# Altium schematic sheet supply.SchDoc
size A4
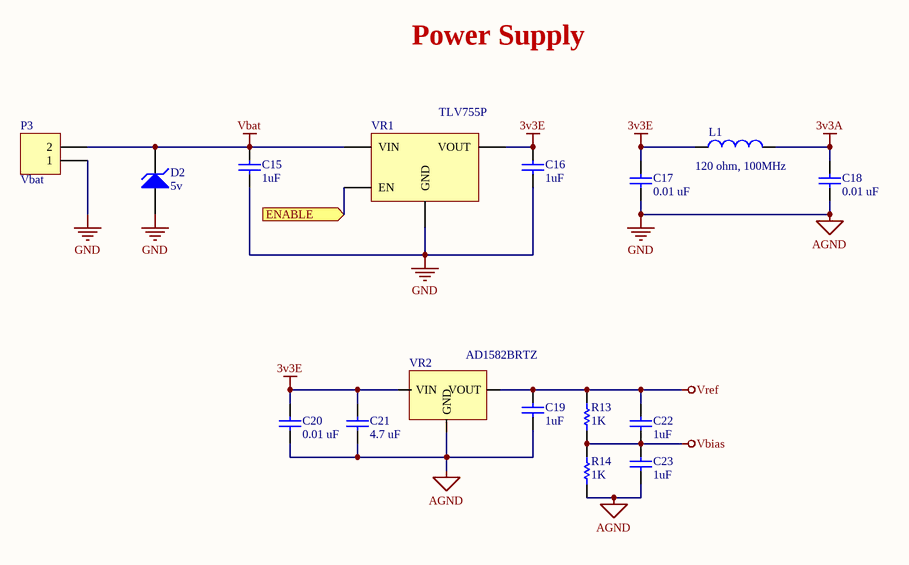
[diagram p0: supply.SchDoc]

## Parts
C15  1uF  [Chip2PinWURTcap]
C16  1uF  [Chip2PinWURTcap]
C17  0.01 uF
C18  0.01 uF
C19  1uF  [Chip2PinWURTcap]
C20  0.01 uF
C21  4.7 uF
C22  1uF  [Chip2PinWURTcap]
C23  1uF  [Chip2PinWURTcap]
D2  5v
L1  120 ohm, 100MHz
P3  Vbat  [HDR1X2]
R13  1K
R14  1K
VR1  TLV755P  [SOT23-TLV755P]
VR2  AD1582BRTZ

## Ports
ENABLE (in)

## Nets
3v3A: C18.1 L1.2
3v3E: C16.1 C17.1 C20.2 C21.2 L1.1 VR1.5(VOUT) VR2.3(VIN)
AGND: C15.2 C16.2 C17.2 C18.2 C19.1 C20.1 C21.1 C23.1 D2.1(A) P3.1 R14.2 VR1.2(GND) VR2.2(GND)  [also labelled GND]
Vbat: C15.1 D2.3(K) P3.2 VR1.1(VIN)
Vbias: C22.1 C23.2 R13.2 R14.1
Vref: C19.2 C22.2 R13.1 VR2.1(VOUT)
ENABLE: VR1.3(EN) ; port ENABLE

## Notes on the sheet
- Power Supply

## Library data of the parts
C15 C16 C19 C22 C23 = 885012206052: Ceramic Capacitors; Manufacturer: Wurth Electronics; Tolerance: 10 %; Voltage Rating DC: 16 VDC; Capacitance - nF: 1000 nF; CNHTS: 8532241000; Dielectric: X7R; TARIC: 8532240000; Published: 8-Jun-2000; LatestRevisionDate: 17-Jul-2002; LatestRevisionNote: Re-released for DXP Platform.; PackageReference: RAD-0.3; Publisher: Altium Limited; PackageDescription: Radial Cap, Thru-Hole; 2 Leads; 0.3 in Pin Spacing; Supplier 1: Mouser; Supplier Part Number 1: 710-885012206052; Manufacturer Part Number: 885012206052; RoHS: RoHS Compliant; Category: Multilayer Ceramic Capacitors MLCC - SMD/SMT; Stock 1: 27157; Pricing 1: 1=0.110, 10=0.104, 50=0.085, 100=0.067, 250=0.059, 500=0.054, 4000=0.054 (EUR); Capacitance: 1 uF; Height: 0.8 mm; Length: 1.6 mm; Package / Case: 0603 (1608 metric); Packaging: Cut Tape; Product: General Type MLCCs; Series: WCAP-CSGP; Termination Style: SMD/SMT; Width: 0.8 mm; Brand: Wurth Electronics; Case Code - in: 0603; Case Code - mm: 1608; HTS Code: 8532240020; Maximum Operating Temperature: + 125 C; Minimum Operating Temperature: - 55 C; Product Type: Ceramic Capacitors; Standard Pack Qty: 4000; Subcategory: Capacitors; RoHS - Mouser: Y; Minimum Order Quantity: 1; Reeling: True; ComponentLink1URL: http://www.mouser.com/datasheet/2/445/885012206052-554330.pdf; ComponentLink1Description: http://www.mouser.com/datasheet/2/445/885012206052-554330.pdf; Value: 1uF
C17 C18 C20 = 885012206089: Multilayer Ceramic Capacitors MLCC - SMD/SMT WCAP-CSGP 0.01uF 0603 10% 50V MLCC; Manufacturer: Wurth Electronics; Voltage Rating DC: 50 VDC; Capacitance - nF: 10 nF; Capacitance - pF: 10000 pF; Dielectric: X7R; Supplier 1: Mouser; Manufacturer Part Number: 885012206089; RoHS: RoHS Compliant; Category: Multilayer Ceramic Capacitors MLCC - SMD/SMT; Stock 1: 174725; Pricing 1: 1=0.040, 10=0.032, 50=0.026, 100=0.021, 250=0.018, 500=0.017, 4000=0.017 (EUR); Capacitance: 0.01 uF; Height: 0.8 mm; Length: 1.6 mm; Package / Case: 0603 (1608 metric); Packaging: Cut Tape; Product: General Type MLCCs; Series: WCAP-CSGP; Termination Style: SMD/SMT; Tolerance: 10 %; Width: 0.8 mm; Brand: Wurth Electronics; Case Code - in: 0603; Case Code - mm: 1608; Maximum Operating Temperature: + 125 C; Minimum Operating Temperature: - 55 C; Product Type: Ceramic Capacitors; Standard Pack Qty: 4000; Subcategory: Capacitors; RoHS - Mouser: Y; Minimum Order Quantity: 1; Reeling: True; ComponentLink1URL: https://www.mouser.com/datasheet/2/445/885012206089-554597.pdf; ComponentLink1Description: https://www.mouser.com/datasheet/2/445/885012206089-554597.pdf; Supplier Part Number 1: 710-885012206089
C21 = 06036D475KAT2A: Multilayer Ceramic Capacitors MLCC - SMD/SMT FACTORY NOT ACCEPTING ORDERS; Manufacturer: AVX; Tolerance: 10 %; Type: Commercial Surface Mount Chip; Voltage Rating DC: 6.3 VDC; Capacitance - nF: 4700 nF; Class: Class 2; Dielectric: X5R; Supplier 1: Mouser; Manufacturer Part Number: 06036D475KAT2A; RoHS: RoHS Compliant By Exemption; Category: Multilayer Ceramic Capacitors MLCC - SMD/SMT; Stock 1: 7820; Pricing 1: 1=0.306, 10=0.216, 100=0.122, 500=0.086, 1000=0.075, 2000=0.063, 4000=0.059, 8000=0.056, 24000=0.050 (EUR); Capacitance: 4.7 uF; Height: 0.9 mm; Length: 1.6 mm; Package / Case: 0603 (1608 metric); Packaging: Reel; Product: General Type MLCCs; Series: X5R; Termination Style: SMD/SMT; Width: 0.81 mm; Brand: AVX; Case Code - in: 0603; Case Code - mm: 1608; Maximum Operating Temperature: + 85 C; Minimum Operating Temperature: - 55 C; Product Type: Ceramic Capacitors; Standard Pack Qty: 4000; Subcategory: Capacitors; RoHS - Mouser: E; Minimum Order Quantity: 8000; Reeling: True; ComponentLink1URL: https://www.mouser.com/datasheet/2/40/cx5r-776519.pdf; ComponentLink1Description: https://www.mouser.com/datasheet/2/40/cx5r-776519.pdf; Supplier Part Number 1: 581-06036D475K
D2 = BZX84B5V1LFHT116: Zener Diodes 5-5.2V 5mA SOT-23; SOT-23; Manufacturer: ROHM Semiconductor; Configuration: Single; Ir - Reverse Current: 2 uA; Pd - Power Dissipation: 250 mW; Voltage Temperature Coefficient: 2.6 mV/C; Zz - Zener Impedance: 60 Ohms; Product Status: New Product; Supplier 1: Mouser; Manufacturer Part Number: BZX84B5V1LFHT116; RoHS: RoHS Compliant; Category: Zener Diodes; Stock 1: 5913; Pricing 1: 1=0.192, 10=0.133, 100=0.055, 1000=0.038, 3000=0.030 (EUR); Height: 0.95 mm; Length: 2.9 mm; Package / Case: SOT-23-3; Packaging: Cut Tape; Width: 1.3 mm; Brand: ROHM Semiconductor; Mounting Style: SMD/SMT; Zener Current: 5 mA; Maximum Operating Temperature: + 150 C; Minimum Operating Temperature: - 65 C; Product Type: Zener Diodes; Standard Pack Qty: 3000; Subcategory: Diodes & Rectifiers; Vz - Zener Voltage: 5 V; RoHS - Mouser: Y; Minimum Order Quantity: 1; Reeling: True; ComponentLink1URL: https://www.mouser.com/datasheet/2/348/bzx84b5v1lfht116-e-1507876.pdf; ComponentLink1Description: https://www.mouser.com/datasheet/2/348/bzx84b5v1lfht116-e-1507876.pdf; Supplier Part Number 1: 755-BZX84B5V1LFHT116
L1 = 2506031217Z0: Ferrite Beads MULTILAYER CHIP BEAD Z=120 OHM@100MHz 25%; Manufacturer: Fair-Rite; Impedance: 120 Ohms; Maximum DC Current: 450 mA; Maximum DC Resistance: 300 mOhms; Type: Multilayer Ferrite Chip Bead; Supplier 1: Mouser; Manufacturer Part Number: 2506031217Z0; RoHS: RoHS Compliant; Category: Ferrite Beads; Stock 1: 9619; Pricing 1: 1=0.032, 2500=0.027, 4000=0.025, 8000=0.024, 24000=0.022, 48000=0.021, 100000=0.018, 400000=0.016 (EUR); Capacitance: -; Height: 0.8 mm; Length: 1.6 mm; Operating Temperature Range: - 55 C to + 125 C; Package / Case: 0603 (1608 metric); Packaging: Cut Tape; Product: Ferrite Chip Beads; Termination Style: SMD/SMT; Tolerance: 25 %; Width: 0.8 mm; Brand: Fair-Rite; Maximum Operating Temperature: + 125 C; Minimum Operating Temperature: - 55 C; Product Type: Ferrite Beads; Standard Pack Qty: 4000; Subcategory: Ferrites; Termination: -; Test Frequency: 100 MHz; RoHS - Mouser: Y; Minimum Order Quantity: 1; Reeling: True; ComponentLink1URL: https://www.mouser.com/datasheet/2/150/2506031217Z0-471794.pdf; ComponentLink1Description: https://www.mouser.com/datasheet/2/150/2506031217Z0-471794.pdf; Supplier Part Number 1: 623-2506031217Z0
P3 = Header 2: Header, 2-Pin; LatestRevisionDate: 17-Jul-2002; LatestRevisionNote: Re-released for DXP Platform.; Publisher: Altium Limited
R13 R14 = CRCW06031K00FKEAC: Thick Film Resistors - SMD 1/10Watt 1Kohms 1% Commercial Use; Manufacturer: Vishay; Power Rating: 100 mW (1/10 W); Temperature Coefficient: 100 PPM / C; Voltage Rating: 75 V; Product Status: New Product; Supplier 1: Mouser; Manufacturer Part Number: CRCW06031K00FKEAC; RoHS: RoHS Compliant By Exemption; Category: Thick Film Resistors - SMD; Stock 1: 673640; Pricing 1: 1=0.087, 10=0.024, 100=0.010, 500=0.006, 1000=0.003, 5000=0.003 (EUR); Features: -; Height: 0.45 mm; Length: 1.55 mm; Package / Case: 0603 (1608 metric); Packaging: Cut Tape; Product: Thick Film Resistors SMD; Resistance: 1 kOhms; Series: CRCW-C e3; Technology: Thick Film; Termination Style: SMD/SMT; Tolerance: 1 %; Width: 0.85 mm; Brand: Vishay; Mounting Style: PCB Mount; Case Code - in: 0603; Case Code - mm: 1608; Maximum Operating Temperature: + 155 C; Minimum Operating Temperature: - 55 C; Product Type: Thick Film Resistors; Standard Pack Qty: 5000; Subcategory: Resistors; RoHS - Mouser: E; Minimum Order Quantity: 1; Reeling: True; ComponentLink1URL: https://www.mouser.com/datasheet/2/427/crcwce3-1223726.pdf; ComponentLink1Description: https://www.mouser.com/datasheet/2/427/crcwce3-1223726.pdf; Supplier Part Number 1: 71-CRCW06031K00FKEAC
VR1 = TLV75533PDBVR: LDO Voltage Regulators 500-mA, Low IQ, Small Size, Low Dropout Regulator 5-SOT-23 -40 to 125; Manufacturer: Texas Instruments; Input Voltage MAX: 5.5 V; Number of Outputs: 1 Output; Output Current: 500 mA; Output Type: Fixed; Output Voltage: 3.3 V; Quiescent Current: 25 uA; Dropout Voltage - Max: 215 mV; PSRR / Ripple Rejection - Typ: 46 dB; Voltage Regulation Accuracy: 1.5 %; CNHTS: 8542319000; Dropout Voltage: 220 mV; Input Voltage MIN: 1.45 V; Line Regulation: 2 mV; Load Regulation: 0.06 V/A; Polarity: Positive; Product Status: New Product; Supplier 1: Mouser; Manufacturer Part Number: TLV75533PDBVR; RoHS: RoHS Compliant; Category: LDO Voltage Regulators; Stock 1: 48621; Pricing 1: 1=0.541, 10=0.454, 100=0.292, 1000=0.234, 2000=0.212, 3000=0.197, 9000=0.190 (EUR); Operating Temperature Range: - 40 C to + 125 C; Package / Case: SOT-23-5; Packaging: Cut Tape; Product: LDO Voltage Regulators; Series: TLV755P; Type: Low Quiescent Current, Ultra Small; Brand: Texas Instruments; Mounting Style: SMD/SMT; Output Voltage Range: -; HTS Code: 8542390001; Maximum Operating Temperature: + 125 C; Minimum Operating Temperature: - 40 C; Product Type: LDO Voltage Regulators; Standard Pack Qty: 3000; Subcategory: PMIC - Power Management ICs; RoHS - Mouser: Y; Minimum Order Quantity: 1; Reeling: True; Supplier Part Number 1: 595-TLV75533PDBVR
VR2 = AD1582BRTZ-REEL7: Voltage References 2.5V MICROPOWER REF IC; Manufacturer: Analog Devices; Accuracy: 3.5 mV/mA; Description/Function: 2.5 V micropower, precision series mode voltage reference; Input Voltage: 2.7 V to 12 V; Output Current: 5 mA; Temperature Coefficient: 50 PPM/C; Reference Type: Series Precision References; Topology: Series References; Operating Supply Current: 70 uA; Supplier 1: Mouser; Manufacturer Part Number: AD1582BRTZ-REEL7; RoHS: RoHS Compliant; Category: Voltage References; Stock 1: 7339; Pricing 1: 1=1.97, 10=1.79, 25=1.60, 100=1.46, 250=1.31, 500=1.14, 1000=0.952, 3000=0.919 (EUR); Height: 1.02 mm (Max); Length: 2.9 mm; Output Voltage: 2.5 V; Package / Case: SOT-23-3; Packaging: Cut Tape; Product: Voltage References; Series: AD1582; Width: 1.3 mm; Brand: Analog Devices; Mounting Style: SMD/SMT; Shunt Current - Max: 5 mA; Load Regulation: 3.5 mV/mA; Maximum Operating Temperature: + 125 C; Minimum Operating Temperature: - 40 C; Product Type: Voltage References; Standard Pack Qty: 3000; Subcategory: PMIC - Power Management ICs; RoHS - Mouser: Y; Minimum Order Quantity: 1; Reeling: True; ComponentLink1URL: https://www.mouser.com/datasheet/2/609/AD1582_1583_1584_1585-876960.pdf; ComponentLink1Description: https://www.mouser.com/datasheet/2/609/AD1582_1583_1584_1585-876960.pdf; Supplier Part Number 1: 584-AD1582BRTZ-R7